# EAGLE design fonte_3v_12v (EAGLE 9.6.2)
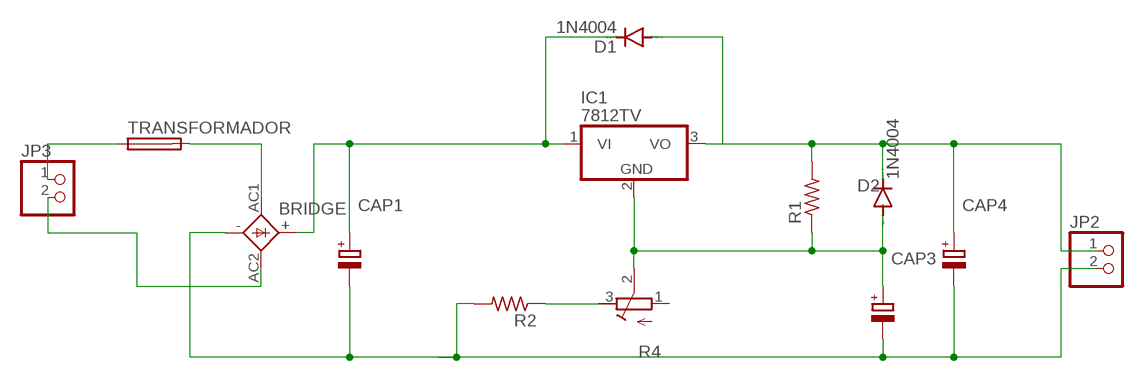
[diagram p0: schematic, sheet 1]

## Parts
BRIDGE  2KBB-R  [2KBB-R]
CAP1  CPOL-EUE5-13  [E5-13]
CAP3  CPOL-EUE5-13  [E5-13]
CAP4  CPOL-EUE5-13  [E5-13]
D1  1N4004  [DO41-10]
D2  1N4004  [DO41-10]
IC1  7812TV  [TO220V]
JP2  PINHD-1X2  [1X02]
JP3  PINHD-1X2  [1X02]
R1  R-US_0204/7  [0204/7]
R2  R-US_0204/7  [0204/7]
R4  R-TRIMM3339P  [RTRIM3339P]
TRANSFORMADOR  SH22,5  [SH22,5]

## Nets
N$1: JP3.1 TRANSFORMADOR.1
N$2: BRIDGE.AC1 TRANSFORMADOR.2
N$3: CAP4.+ D1.A D2.C IC1.3(VO) JP2.1 R1.2
N$4: BRIDGE.AC2 JP3.2
N$5: BRIDGE.+ CAP1.+ D1.C IC1.1(VI)
N$6: R2.1 R4.3(E)
N$8: BRIDGE.- CAP1.- CAP3.- CAP4.- JP2.2 R2.2
N$9: CAP3.+ D2.A IC1.2(GND) R1.1 R4.2(S)
Unconnected: R4.1(A)

## Library data of the parts
BRIDGE = rectifier:2KBB-R: RECTIFIER grid 3 x 5 mm
CAP1 CAP3 CAP4 = rcl:CPOL-EU: POLARIZED CAPACITOR, European symbol; SPICEPREFIX: C
D1 D2 = diode:1N4004: DIODE general purpose rectifier, 1 A
IC1 = linear:78*: Positive VOLTAGE REGULATOR Source: http://cache.national.com/ds/LM/LM78L05.pdf http://www.fairchildsemi.com/ds/LM/LM7805.pdf
JP2 JP3 = pinhead:PINHD-1X2: PIN HEADER
R1 R2 = rcl:R-US_: RESISTOR, American symbol; SPICEPREFIX: R
R4 = rcl:R-TRIMM: Trimm resistor; SPICEMODEL: X; SPICEPREFIXL: POT
TRANSFORMADOR = fuse:SH22,5: FUSE HOLDER grid 22,5 mm, OGN0031 8201, Schurter (Buerklin); MF: SCHURTER; MPN: 0031.8201; OC_FARNELL: 1162740; OC_NEWARK: 96F8317

## Board
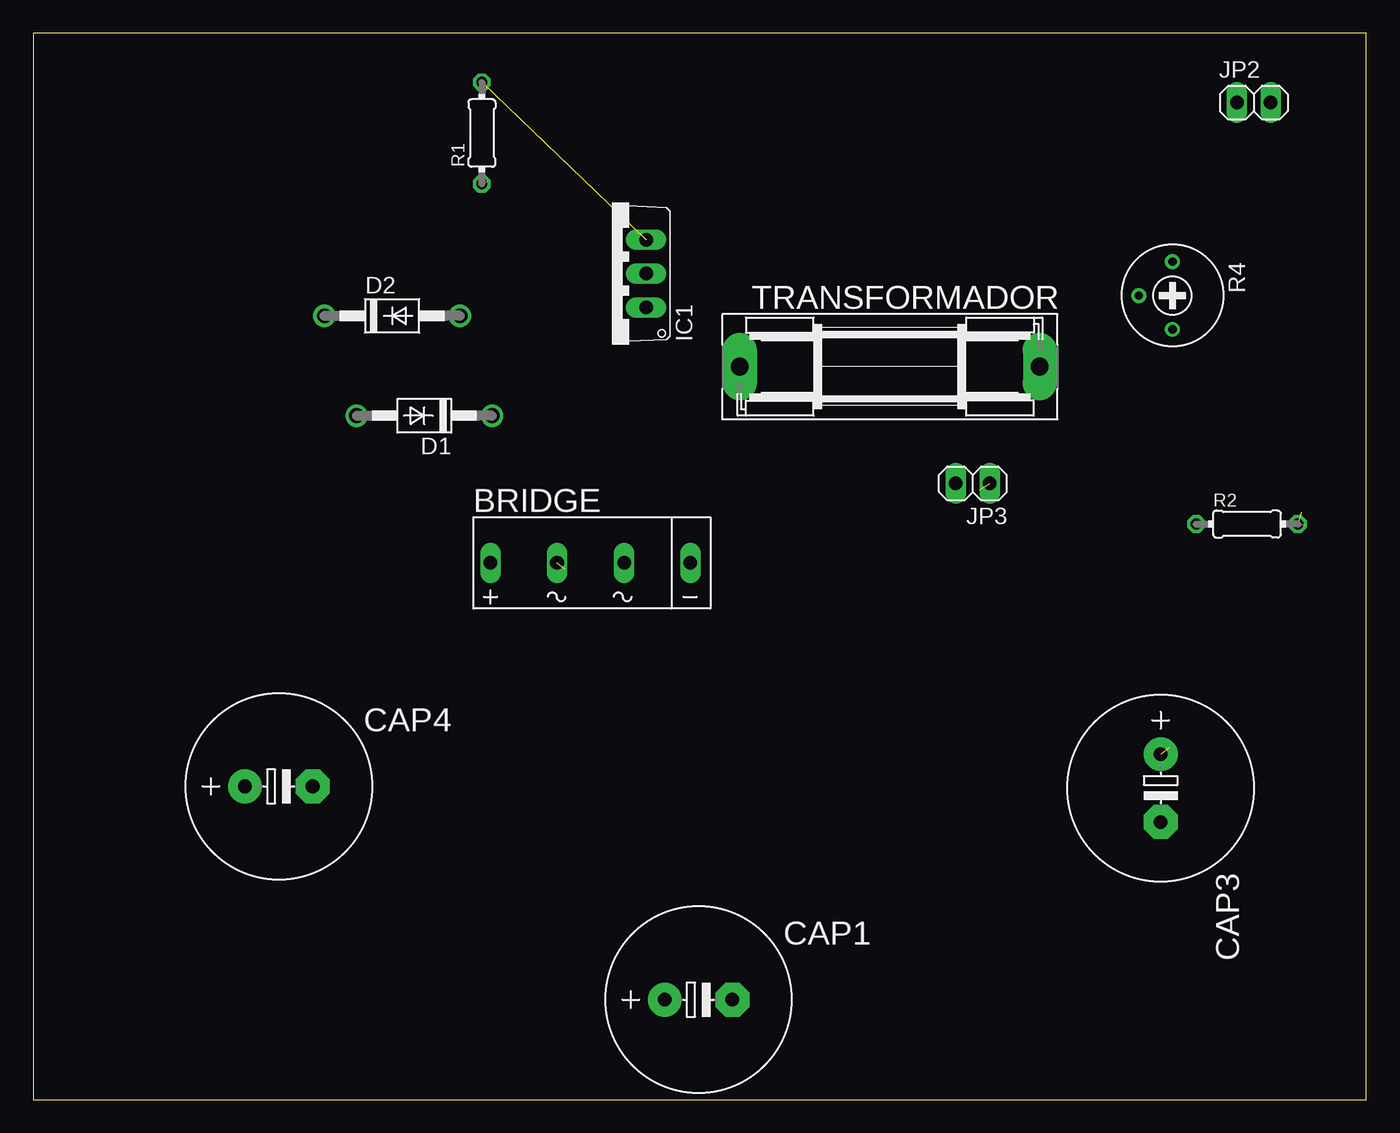
[diagram p1: board, top side]
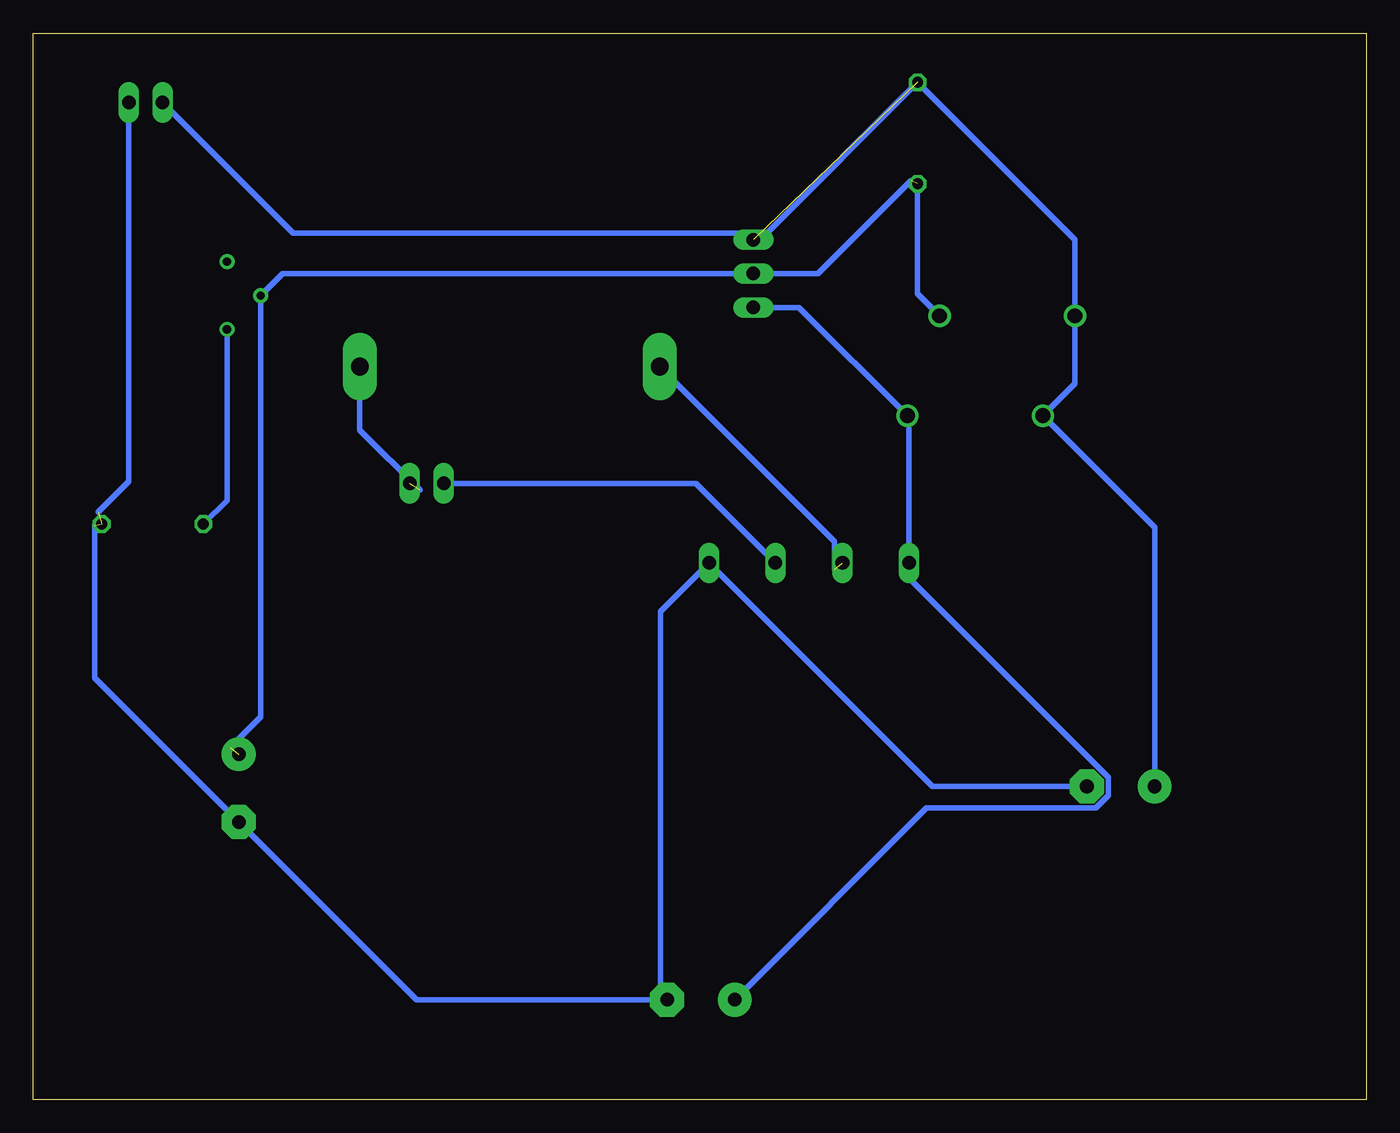
[diagram p2: board, bottom side, seen from below]

Size 100 x 80 mm. Coordinates in mm from the lower left corner, seen from the top.
Outline: 0,0 100,0 100,80 0,80 0,0
Copper layers (1*16): Top 0.035mm / dielectric 1.5mm / Bottom 0.035mm
Design rules "default": minimum track width 6mil, minimum drill 0.35mm, track to track 6mil, track to pad 6mil, pad to pad 6mil, via to via 6mil, smd to smd 6mil, copper to edge 40mil, drill to drill 6mil, minimum pad ring 10mil, minimum via ring 8mil, stop-mask expansion 4mil, vias tented up to drill 0mil, thermal gap 10mil

### Footprints (pad centres in the part's own frame; a part is rotated, then mirrored left to right if it is on the bottom)
2KBB-R = drill 1.016 long: + -7.62,0; - 7.391,0; AC1 -2.616,0; AC2 2.413,0
E5-13 = drill 1.016 pad 2.54: + -2.54,0 | drill 1.016 pad 2.54 octagon: - 2.54,0
DO41-10 = drill 1.118: A 5.08,0; C -5.08,0
TO220V = drill 1.016 long: 1 -2.54,-2.54; 2 0,-2.54; 3 2.54,-2.54
1X02 = drill 1.016 long: 1 -1.27,0; 2 1.27,0
0204/7 = drill 0.813 octagon: 1 -3.81,0; 2 3.81,0
RTRIM3339P = drill 0.61: 1 -2.54,0; 2 0,-2.54; 3 2.54,0
SH22,5 = drill 1.321 pad 2.54 long: 1 -11.252,0; 2 11.252,0

### Placement (x,y rotation side)
BRIDGE  41.91,40.26 0 top
CAP1  49.91,7.49 0 top
CAP3  84.58,23.37 270 top
CAP4  18.41,23.5 0 top
D1  29.34,51.31 180 top
D2  26.92,58.8 0 top
IC1  43.43,61.98 90 top
JP2  91.57,74.8 0 top
JP3  70.48,46.23 180 top
R1  33.66,72.52 90 top
R2  91.06,43.18 0 top
R4  85.47,60.33 270 top
TRANSFORMADOR  64.26,54.99 180 top

### Tracks (layer width: path | path; a pad name or v marks a point on that pad's centre or on a via)
N$1  (1 unrouted)
  Bottom 0.406: TRANSFORMADOR.1 75.51,50.24 70.99,45.72
N$2  (1 unrouted)
  Bottom 0.406: TRANSFORMADOR.2 39.88,41.86 39.88,39.75
N$3  (1 unrouted)
  Bottom 0.406: JP2.1 80.52,65.02 44.96,65.02 R1.2 21.84,64.52 D2.C 21.84,53.72 D1.A 15.88,42.93 CAP4.+
N$4
  Bottom 0.406: BRIDGE.AC2 50.29,46.23 JP3.2
N$5
  Bottom 0.406: IC1.1 42.55,59.44 D1.C 34.29,51.18 BRIDGE.+ 34.29,39.13 19.33,24.17 19.33,22.82 20.28,21.87 32.99,21.87 CAP1.+
N$6
  Bottom 0.406: R2.1 85.47,44.96 R4.3
N$8  (2 unrouted)
  Bottom 0.406: CAP1.- 52.96,7.49 | 52.96,7.49 71.25,7.49 CAP3.- 95.38,31.62 95.38,43.05 | JP2.2 92.84,46.35 95.12,44.07 | 52.96,7.49 52.96,36.6 BRIDGE.- 32.54,23.5 CAP4.-
N$9  (2 unrouted)
  Bottom 0.406: D2.A 33.66,60.45 R1.1 | 34.16,68.96 41.15,61.98 IC1.2 81.28,61.98 R4.2 82.93,28.7 85.22,26.42